# EAGLE schematic main (EAGLE 6.5.0)
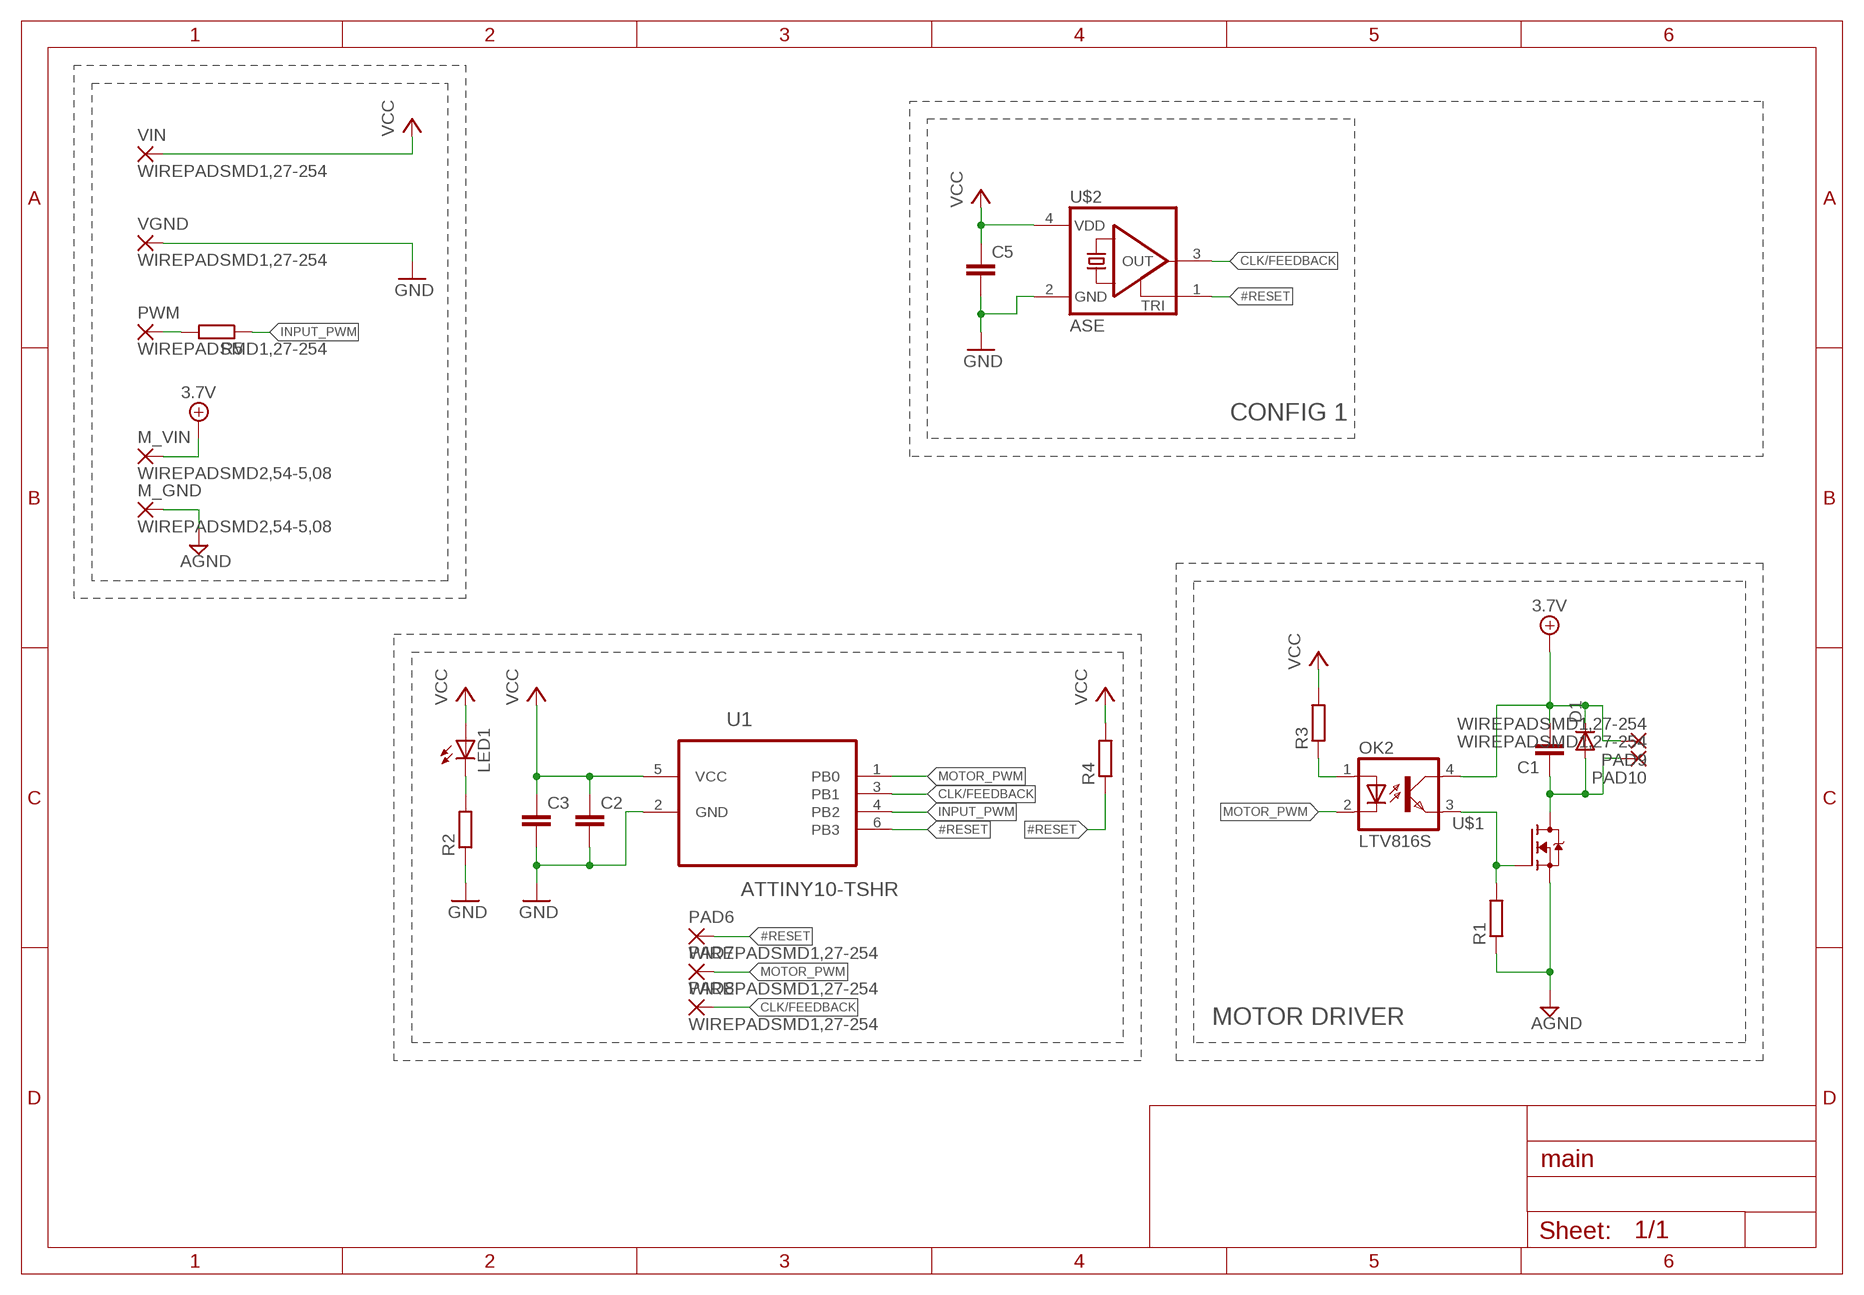
[diagram p0: schematic, sheet 1]

## Parts
C1  C-EUC0603K  [C0603K]
C2  C-EUC1206K  [C1206K]
C3  C-EUC0603K  [C0603K]
C5  C-EUC0603K  [C0603K]
D1  DIODE-MINIMELF  [MINIMELF]
LED1  LEDSML0603  [SML0603]
M_GND  WIREPADSMD2,54-5,08  [SMD2,54-5,08]
M_VIN  WIREPADSMD2,54-5,08  [SMD2,54-5,08]
OK2  LTV816S  [SMD4]
PAD6  WIREPADSMD1,27-254  [SMD1,27-2,54]
PAD7  WIREPADSMD1,27-254  [SMD1,27-2,54]
PAD8  WIREPADSMD1,27-254  [SMD1,27-2,54]
PAD9  WIREPADSMD1,27-254  [SMD1,27-2,54]
PAD10  WIREPADSMD1,27-254  [SMD1,27-2,54]
PWM  WIREPADSMD1,27-254  [SMD1,27-2,54]
R1  R-EU_R0603  [R0603]
R2  R-EU_R0603  [R0603]
R3  R-EU_R0603  [R0603]
R4  R-EU_R0603  [R0603]
R5  R-EU_R0603  [R0603]
U1  ATTINY10-TSHR  [SOT95P280X145-6N]
U$1  IRLML0030  [SOT23]
U$2  ASE  [ASE]
VGND  WIREPADSMD1,27-254  [SMD1,27-2,54]
VIN  WIREPADSMD1,27-254  [SMD1,27-2,54]

## Nets
#RESET: PAD6.1(P) R4.1 U1.6(PB3) U$2.1(TRI)
+12V: C1.2 D1.C M_VIN.1(P) OK2.4(COL) PAD9.1(P) ; supply symbol labelled 3.7V
AGND: M_GND.1(P) R1.1 U$1.2(S)
CLK/FEEDBACK: PAD8.1(P) U1.3(PB1) U$2.3(OUT)
GND: C2.2 C3.2 C5.2 R2.1 U1.2(GND) U$2.2(GND) VGND.1(P)
INPUT_PWM: R5.1 U1.4(PB2)
MOTOR_PWM: OK2.2(C) PAD7.1(P) U1.1(PB0)
N$1: OK2.1(A) R3.1
N$4: C1.1 D1.A PAD10.1(P) U$1.3(D)
N$7: OK2.3(EMIT) R1.2 U$1.1(G)
N$10: LED1.C R2.2
N$13: PWM.1(P) R5.2
VCC: C2.1 C3.1 C5.1 LED1.A R3.2 R4.2 U1.5(VCC) U$2.4(VDD) VIN.1(P)

## Notes on the sheet
- CONFIG 1
- MOTOR DRIVER

## Library data of the parts
C1-C3 C5 = rcl:C-EU: CAPACITOR, European symbol
D1 = diode:DIODE-: DIODE
LED1 = led:LED: LED OSRAM: - CHIPLED LG R971, LG N971, LY N971, LG Q971, LY Q971, LO R971, LY R971 LH N974, LH R974 LS Q976, LO Q976, LY Q976 LO Q996 - Hyper CHIPLED LW Q18S LB Q993, LB Q99A, LB R99A - SideLED LS A670, LO A670, LY A670, LG A670, LP A670 LB A673, LV A673, LT A673, LW A673 LH A674 LY A675 LS A676, LA A676, LO A676, LY A676, LW A676 LS A679, LY A679, LG A679 - Hyper Micro SIDELED® LS Y876, LA Y876, LO Y876, LY Y876 LT Y87S - SmartLED LW L88C, LW L88S LB L89C, LB L89S, LG L890 LS L89K, LO L89K, LY L89K LS L896, LA L896, LO L896, LY L896 - TOPLED LS T670, LO T670, LY T670, LG T670, LP T670 LSG T670, LSP T670, LSY T670, LOP T670, LYG T670 LG T671, LOG T671, LSG T671 LB T673, LV T673, LT T673, LW T673 LH T674 LS T676, LA T676, LO T676, LY T676, LB T676, LH T676, LSB T676, LW T676 LB T67C, LV T67C, LT T67C, LS T67K, LO T67K, LY T67K, LW E67C LS E67B, LA E67B, LO E67B, LY E67B, LB E67C, LV E67C, LT E67C LW T67C LS T679, LY T679, LG T679 LS T770, LO T770, LY T770, LG T770, LP T770 LB T773, LV T773, LT T773, LW T773 LH T774 LS E675, LA E675, LY E675, LS T675 LS T776, LA T776, LO T776, LY T776, LB T776 LHGB T686 LT T68C, LB T68C - Hyper Mini TOPLED® LB M676 - Mini TOPLED Santana® LG M470 LS M47K, LO M47K, LY M47K Source: http://www.osram.convergy.de LUXEON: - LUMILED® LXK2-PW12-R00, LXK2-PW12-S00, LXK2-PW14-U00, LXK2-PW14-V00 LXK2-PM12-R00, LXK2-PM12-S00, LXK2-PM14-U00 LXK2-PE12-Q00, LXK2-PE12-R00, LXK2-PE12-S00, LXK2-PE14-T00, LXK2-PE14-U00 LXK2-PB12-K00, LXK2-PB12-L00, LXK2-PB12-M00, LXK2-PB14-N00, LXK2-PB14-P00, LXK2-PB14-Q00 LXK2-PR12-L00, LXK2-PR12-M00, LXK2-PR14-Q00, LXK2-PR14-R00 LXK2-PD12-Q00, LXK2-PD12-R00, LXK2-PD12-S00 LXK2-PH12-R00, LXK2-PH12-S00 LXK2-PL12-P00, LXK2-PL12-Q00, LXK2-PL12-R00 Source: www.luxeon.com KINGBRIGHT: KA-3528ASYC Source: www.kingbright.com
M_GND M_VIN PAD6-PAD10 PWM VGND VIN = wirepad:WIREPAD: Wire PAD connect wire on PCB
OK2 = optocoupler:LTV816: OPTO COUPLER Source: LITEON, LTV816.pdf; OC_FARNELL: unknown; OC_NEWARK: unknown
R1-R5 = rcl:R-EU_: RESISTOR, European symbol
U1 = Atmel_By_element14_Batch_1-00:ATTINY10-TSHR: 8-bit Microcontroller with In-System Programmable Flash; MPN: ATTINY10-TSHR; OC_FARNELL: 1748538; OC_NEWARK: 26R5645; PACKAGE: SOT-23-6; SUPPLIER: Atmel
U$1 = transistor-fet:IRLML0030
U$2 = crystal:ASE: 3.3Vdc CMOS SMD CRYSTAL CLOCK OSCILLATOR SOurce: www.abracon.com; OC_FARNELL: unknown; OC_NEWARK: unknown